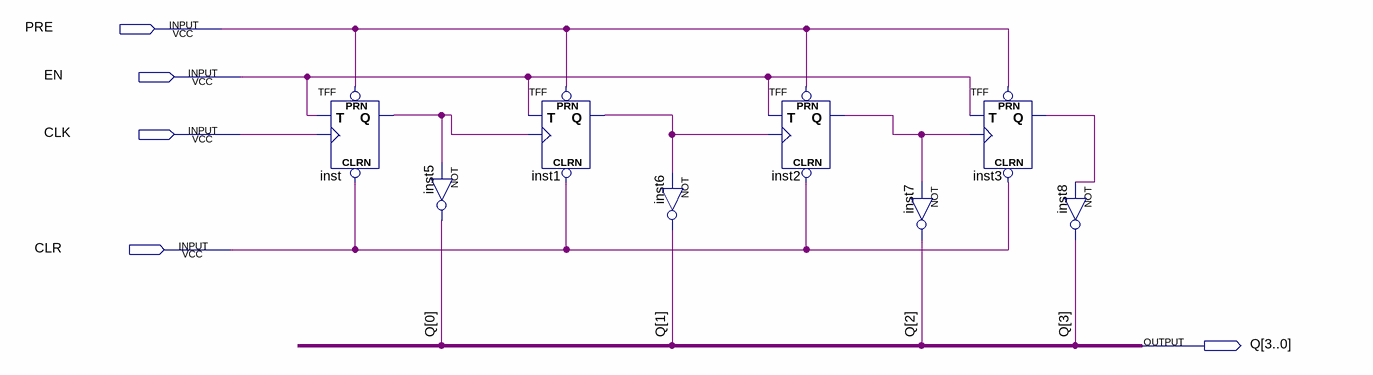
[diagram p0: schematic sheet]
// Quartus schematic compteur4bits.bdf as structural Verilog: 8 symbols, 5 pins
module compteur4bits (
  input  PRE,
  input  EN,
  input  CLK,
  input  CLR,
  output [3:0] Q
);

  wire inst1_q, inst2_q, inst3_q, inst_q;

  TFF inst (.PRN(PRE), .CLRN(CLR), .T(EN), .CLK(CLK), .Q(inst_q));
  not inst5 (Q[0], inst_q);
  TFF inst1 (.PRN(PRE), .CLRN(CLR), .T(EN), .CLK(inst_q), .Q(inst1_q));
  not inst6 (Q[1], inst1_q);
  TFF inst2 (.PRN(PRE), .CLRN(CLR), .T(EN), .CLK(inst1_q), .Q(inst2_q));
  not inst7 (Q[2], inst2_q);
  TFF inst3 (.PRN(PRE), .CLRN(CLR), .T(EN), .CLK(inst2_q), .Q(inst3_q));
  not inst8 (Q[3], inst3_q);
endmodule
